# EAGLE design connection (EAGLE 7.2.1)
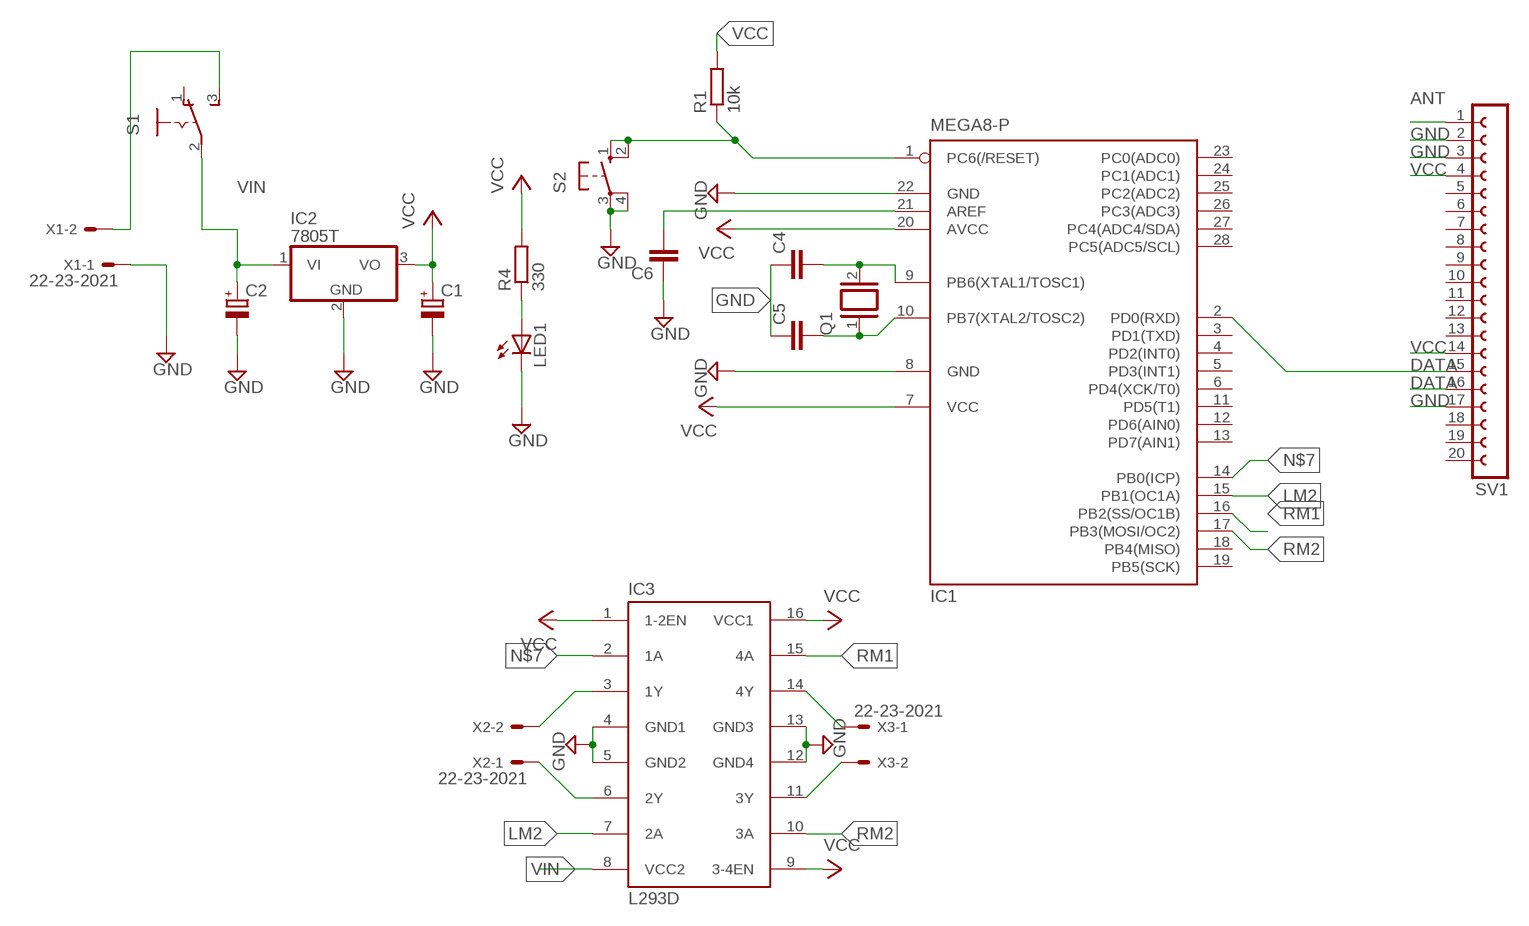
[diagram p0: schematic, sheet 1]

## Parts
C1  CPOL-EUE3.5-8  [E3,5-8]
C2  CPOL-EUE3.5-8  [E3,5-8]
C4  C5/2.5  [C5B2.5]
C5  C5/2.5  [C5B2.5]
C6  C5/2.5  [C5B2.5]
IC1  MEGA8-P  [DIL28-3]
IC2  7805T  [TO220H]
IC3  L293D  [DIL16]
LED1  LED5MM  [LED5MM]
Q1  XTAL/S  [QS]
R1  10k  R-EU_0207/10  [0207/10]
R4  330  R-EU_0207/10  [0207/10]
S1  255SB  [255SB]
S2  10-XX  [B3F-10XX]
SV1  FE20-1  [FE20]
X1  22-23-2021  [22-23-2021]
X2  22-23-2021  [22-23-2021]
X3  22-23-2021  [22-23-2021]

## Nets
ANT: SV1.1
DATA: IC1.2(PD0(RXD)) SV1.15 SV1.16
GND: C1.- C2.- C4.1 C5.1 C6.1 IC1.8(GND) IC1.22(GND) IC2.2(GND) IC3.4(GND1) IC3.5(GND2) IC3.12(GND4) IC3.13(GND3) LED1.K(C) S2.3(P) S2.4(P1) SV1.2 SV1.3 SV1.17 X1.1
LM2: IC1.15(PB1(OC1A)) IC3.7(2A)
N$1: IC1.1(PC6(/RESET)) R1.1 S2.1(S) S2.2(S1)
N$2: C6.2 IC1.21(AREF)
N$3: C4.2 IC1.9(PB6(XTAL1/TOSC1)) Q1.2
N$4: C5.2 IC1.10(PB7(XTAL2/TOSC2)) Q1.1
N$5: S1.3(S) X1.2
N$7: IC1.14(PB0(ICP)) IC3.2(1A)
N$8: IC3.3(1Y) X2.2
N$9: IC3.6(2Y) X2.1
N$10: IC3.14(4Y) X3.1
N$12: IC3.11(3Y) X3.2
N$13: LED1.A R4.1
RM1: IC1.16(PB2(SS/OC1B)) IC3.15(4A)
RM2: IC1.17(PB3(MOSI/OC2)) IC3.10(3A)
VCC: C1.+ IC1.7(VCC) IC1.20(AVCC) IC2.3(VO) IC3.1(1-2EN) IC3.9(3-4EN) IC3.16(VCC1) R1.2 R4.2 SV1.4 SV1.14
VIN: C2.+ IC2.1(VI) IC3.8(VCC2) S1.2(P)
Unconnected: IC1.3(PD1(TXD)) IC1.4(PD2(INT0)) IC1.5(PD3(INT1)) IC1.6(PD4(XCK/T0)) IC1.11(PD5(T1)) IC1.12(PD6(AIN0)) IC1.13(PD7(AIN1)) IC1.18(PB4(MISO)) IC1.19(PB5(SCK)) IC1.23(PC0(ADC0)) IC1.24(PC1(ADC1)) IC1.25(PC2(ADC2)) IC1.26(PC3(ADC3)) IC1.27(PC4(ADC4/SDA)) IC1.28(PC5(ADC5/SCL)) S1.1(O) SV1.5 SV1.6 SV1.7 SV1.8 SV1.9 SV1.10 SV1.11 SV1.12 SV1.13 SV1.18 SV1.19 SV1.20

## Library data of the parts
C1 C2 = resistor:CPOL-EU: POLARIZED CAPACITOR, European symbol
C4-C6 = capacitor-wima:C: CAPACITOR naming: grid - package width
IC1 = atmel:MEGA8-P: MICROCONTROLLER 8 Kbytes FLASH, 1 kbytes SRAM, 512 bytes EEPROM, USART, 4-channel 10 bit ADC, 2-channel 8 bit ADC Pin compatible with Atmega48, ATMega88, ATMega168 Source: avr.lbr; OC_FARNELL: unknown; OC_NEWARK: unknown
IC2 = linear:78*: Positive VOLTAGE REGULATOR Source: http://cache.national.com/ds/LM/LM78L05.pdf http://www.fairchildsemi.com/ds/LM/LM7805.pdf
IC3 = st-microelectronics:L293D: PUSH-PULL 4 CHANNEL DRIVER; MPN: L293D; OC_FARNELL: 9589619; OC_NEWARK: 56P8249
LED1 = led:LED: LED OSRAM: - CHIPLED LG R971, LG N971, LY N971, LG Q971, LY Q971, LO R971, LY R971 LH N974, LH R974 LS Q976, LO Q976, LY Q976 LO Q996 - Hyper CHIPLED LW Q18S LB Q993, LB Q99A, LB R99A - SideLED LS A670, LO A670, LY A670, LG A670, LP A670 LB A673, LV A673, LT A673, LW A673 LH A674 LY A675 LS A676, LA A676, LO A676, LY A676, LW A676 LS A679, LY A679, LG A679 - Hyper Micro SIDELED® LS Y876, LA Y876, LO Y876, LY Y876 LT Y87S - SmartLED LW L88C, LW L88S LB L89C, LB L89S, LG L890 LS L89K, LO L89K, LY L89K LS L896, LA L896, LO L896, LY L896 - TOPLED LS T670, LO T670, LY T670, LG T670, LP T670 LSG T670, LSP T670, LSY T670, LOP T670, LYG T670 LG T671, LOG T671, LSG T671 LB T673, LV T673, LT T673, LW T673 LH T674 LS T676, LA T676, LO T676, LY T676, LB T676, LH T676, LSB T676, LW T676 LB T67C, LV T67C, LT T67C, LS T67K, LO T67K, LY T67K, LW E67C LS E67B, LA E67B, LO E67B, LY E67B, LB E67C, LV E67C, LT E67C LW T67C LS T679, LY T679, LG T679 LS T770, LO T770, LY T770, LG T770, LP T770 LB T773, LV T773, LT T773, LW T773 LH T774 LS E675, LA E675, LY E675, LS T675 LS T776, LA T776, LO T776, LY T776, LB T776 LHGB T686 LT T68C, LB T68C - Hyper Mini TOPLED® LB M676 - Mini TOPLED Santana® LG M470 LS M47K, LO M47K, LY M47K Source: http://www.osram.convergy.de LUXEON: - LUMILED® LXK2-PW12-R00, LXK2-PW12-S00, LXK2-PW14-U00, LXK2-PW14-V00 LXK2-PM12-R00, LXK2-PM12-S00, LXK2-PM14-U00 LXK2-PE12-Q00, LXK2-PE12-R00, LXK2-PE12-S00, LXK2-PE14-T00, LXK2-PE14-U00 LXK2-PB12-K00, LXK2-PB12-L00, LXK2-PB12-M00, LXK2-PB14-N00, LXK2-PB14-P00, LXK2-PB14-Q00 LXK2-PR12-L00, LXK2-PR12-M00, LXK2-PR14-Q00, LXK2-PR14-R00 LXK2-PD12-Q00, LXK2-PD12-R00, LXK2-PD12-S00 LXK2-PH12-R00, LXK2-PH12-S00 LXK2-PL12-P00, LXK2-PL12-Q00, LXK2-PL12-R00 Source: www.luxeon.com KINGBRIGHT: KA-3528ASYC Source: www.kingbright.com
Q1 = special:XTAL/S: CRYSTAL
R1 R4 = resistor:R-EU_: RESISTOR, European symbol
S1 = switch:255SB: SLIDING SWITCH Distributor Buerklin, 11G810
S2 = switch-omron:10-XX: OMRON SWITCH; MPN: B3F-1000; OC_FARNELL: 176432; OC_NEWARK: 36M3542
SV1 = con-lsta:FE20-1: FEMALE HEADER; OC_FARNELL: unknown; OC_NEWARK: unknown
X1-X3 = con-molex:22-23-2021: .100" (2.54mm) Center Header - 2 Pin; MF: MOLEX; MPN: 22-23-2021; OC_FARNELL: 1462926; OC_NEWARK: 25C3832

## Board
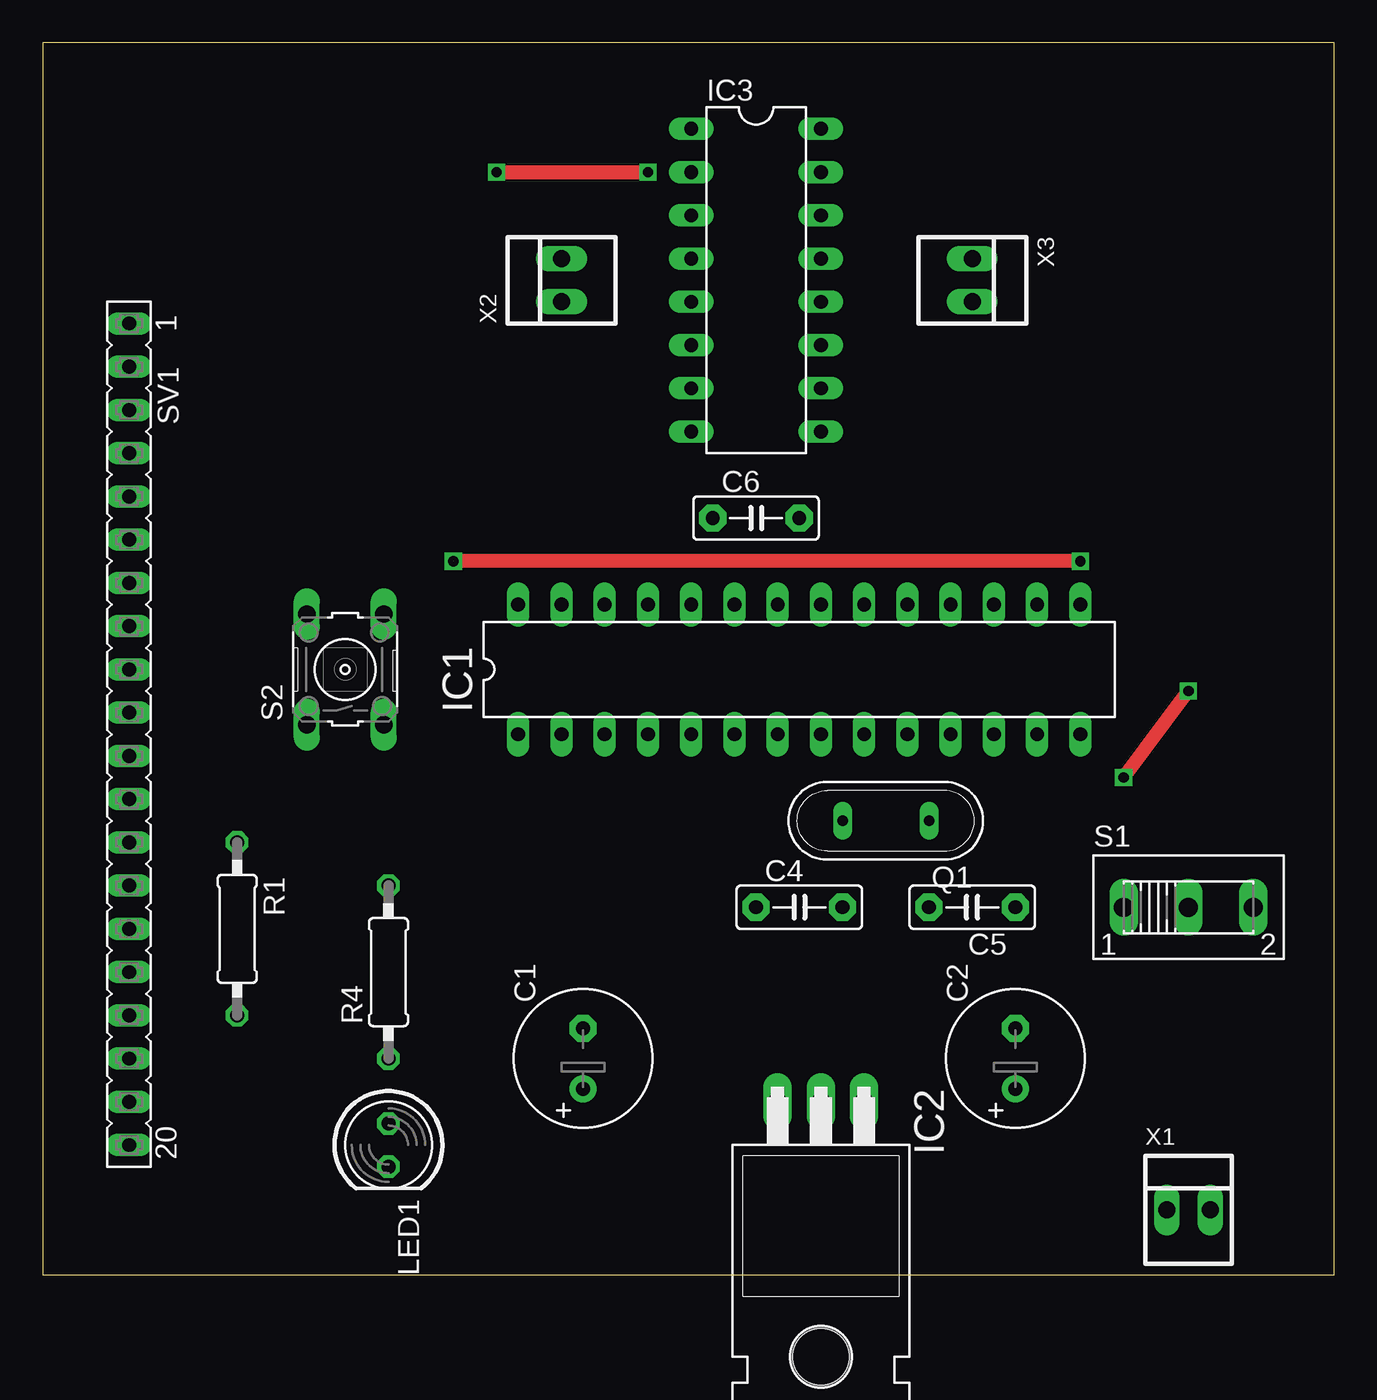
[diagram p1: board, top side]
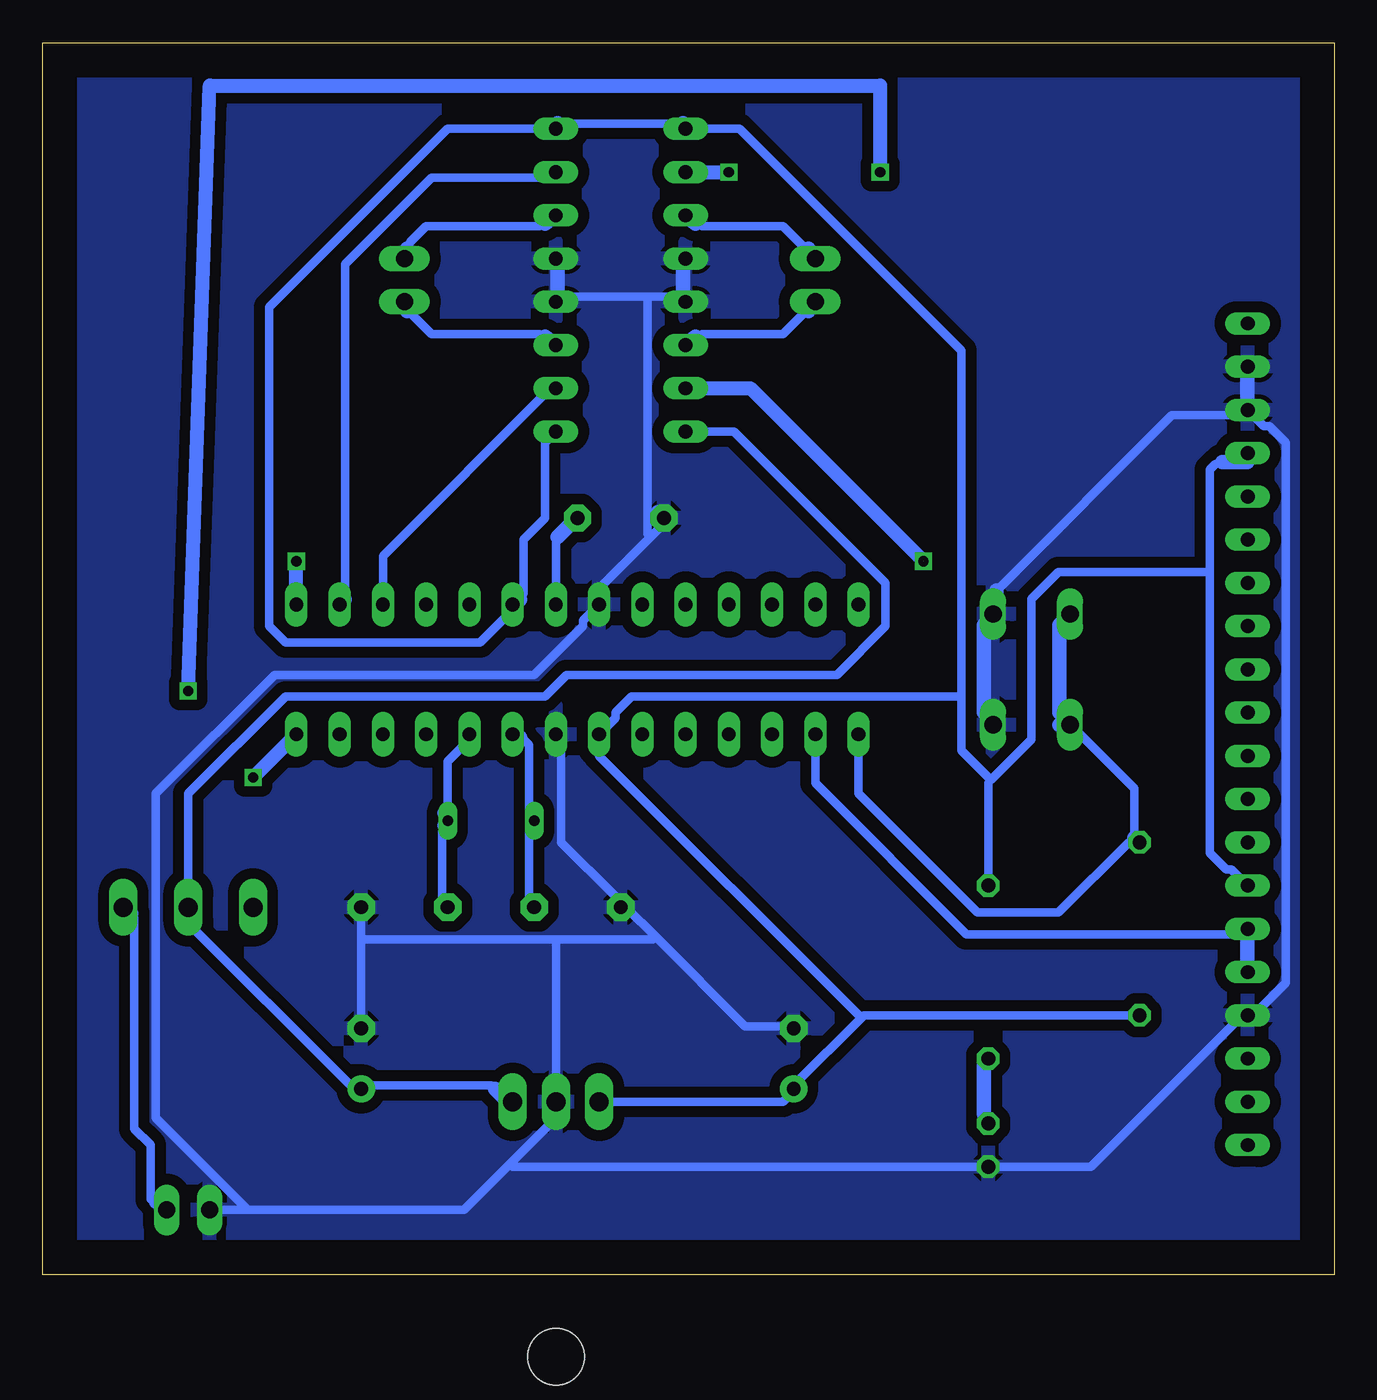
[diagram p2: board, bottom side, seen from below]

Size 75.87 x 72.38 mm. Coordinates in mm from the lower left corner, seen from the top.
Outline: 0,0 75.87,0 75.87,72.38 0,72.38 0,0
Copper layers (1*16): Top 0.035mm / dielectric 1.5mm / Bottom 0.035mm
Design rules "default *": minimum track width 20mil, minimum drill 24mil, track to track 25mil, track to pad 30mil, pad to pad 25mil, via to via 25mil, smd to smd 25mil, copper to edge 80mil, drill to drill 8mil, minimum pad ring 10mil, minimum via ring 8mil, stop-mask expansion 4mil, vias tented up to drill 0mil, thermal gap 10mil

### Footprints (pad centres in the part's own frame; a part is rotated, then mirrored left to right if it is on the bottom)
E3,5-8 = drill 0.813 pad 1.6: + -1.778,0 | drill 0.813 pad 1.6 octagon: - 1.778,0
C5B2.5 = drill 0.813 pad 1.6 octagon: 1 -2.54,0; 2 2.54,0
DIL28-3 = drill 0.813 long: 1 -16.51,-3.81; 2 -13.97,-3.81; 3 -11.43,-3.81; 4 -8.89,-3.81; 5 -6.35,-3.81; 6 -3.81,-3.81; 7 -1.27,-3.81; 8 1.27,-3.81; 9 3.81,-3.81; 10 6.35,-3.81; 11 8.89,-3.81; 12 11.43,-3.81; 13 13.97,-3.81; 14 16.51,-3.81; 15 16.51,3.81; 16 13.97,3.81; 17 11.43,3.81; 18 8.89,3.81; 19 6.35,3.81; 20 3.81,3.81; 21 1.27,3.81; 22 -1.27,3.81; 23 -3.81,3.81; 24 -6.35,3.81; 25 -8.89,3.81; 26 -11.43,3.81; 27 -13.97,3.81; 28 -16.51,3.81
TO220H = drill 1.118 long: 1 -2.54,-10.16; 2 0,-10.16; 3 2.54,-10.16 | hole 3.302: 0,4.826
DIL16 = drill 0.813 long: 1 -8.89,-3.81; 2 -6.35,-3.81; 3 -3.81,-3.81; 4 -1.27,-3.81; 5 1.27,-3.81; 6 3.81,-3.81; 7 6.35,-3.81; 8 8.89,-3.81; 9 8.89,3.81; 10 6.35,3.81; 11 3.81,3.81; 12 1.27,3.81; 13 -1.27,3.81; 14 -3.81,3.81; 15 -6.35,3.81; 16 -8.89,3.81
LED5MM = drill 0.813 octagon: A -1.27,0; K 1.27,0
QS = drill 0.61 long: 1 -2.54,0; 2 2.54,0
0207/10 = drill 0.813 octagon: 1 -5.08,0; 2 5.08,0
255SB = drill 1.118 long: 1 -3.81,0; 2 0,0; 3 3.81,0
B3F-10XX = drill 1.016 long: 1 -3.251,2.261; 2 3.251,2.261; 3 -3.251,-2.261; 4 3.251,-2.261
FE20 = drill 0.813 long: 1 -24.13,0; 2 -21.59,0; 3 -19.05,0; 4 -16.51,0; 5 -13.97,0; 6 -11.43,0; 7 -8.89,0; 8 -6.35,0; 9 -3.81,0; 10 -1.27,0; 11 1.27,0; 12 3.81,0; 13 6.35,0; 14 8.89,0; 15 11.43,0; 16 13.97,0; 17 16.51,0; 18 19.05,0; 19 21.59,0; 20 24.13,0
22-23-2021 = drill 1 long: 1 -1.27,0; 2 1.27,0

### Placement (x,y rotation side)
C1  31.75,12.7 90 top
C2  57.15,12.7 90 top
C4  44.45,21.59 0 top
C5  54.61,21.59 180 top
C6  41.91,44.45 0 top
IC1  44.45,35.56 0 top
IC2  45.72,0 180 top
IC3  41.91,58.42 270 top
LED1  20.32,7.62 270 top
Q1  49.53,26.67 180 top
R1  11.43,20.32 270 top
R4  20.32,17.78 90 top
S1  67.31,21.59 0 top
S2  17.78,35.56 90 top
SV1  5.08,31.75 270 top
X1  67.31,3.81 0 top
X2  30.48,58.42 90 top
X3  54.61,58.42 270 top

### Tracks (layer width: path | path; a pad name or v marks a point on that pad's centre or on a via)
DATA
  Bottom 0.508: IC1.2 30.48,28.89 21.59,20 5.4,20 SV1.15
  Bottom 0.838: SV1.16 5.1,18.29 5.1,19.76 SV1.15
GND
  Bottom 0.508: 19.84,40.18 19.68,40.32 9.52,50.48 5.4,50.48 SV1.3 4.13,49.85 3.81,49.85 2.86,48.89 2.86,17.14 4.76,15.24 SV1.17 5.4,15.24 14.29,6.35 LED1.K 48.26,6.35 48.42,6.51 | C5.1 57.15,19.69 | 57.15,19.69 C2.- | IC1.8 45.4,31.43 45.4,25.4 42.23,22.23 C4.1 41.59,21.59 39.85,19.84 | 39.85,19.84 34.61,14.6 31.75,14.6 C1.- | 45.72,19.69 40.01,19.69 39.85,19.84 | 45.72,19.69 57.15,19.69 | 40.32,57.47 45.4,57.47 IC3.12 | 40.32,57.47 38.42,57.47 IC3.5 | 40.16,43.34 39.37,44.13 C6.1 | 40.16,43.34 43.18,40.32 IC1.22 44.13,38.42 44.13,38.1 46.99,35.24 62.23,35.24 69.22,28.26 69.22,9.21 63.82,3.81 | 40.32,57.47 40.32,43.5 40.16,43.34 | 63.82,3.81 51.12,3.81 48.42,6.51 | 63.82,3.81 X1.1 | 48.42,6.51 45.72,9.21 IC2.2 45.72,19.69
  Bottom 0.838: SV1.2 5.1,52.91 5.1,51.43 SV1.3 5.1,50.7 | S2.3 20.57,33.02 20.57,38.18 S2.4 19.84,40.18 | 45.62,31.55 IC1.8 | 41.94,21.97 C4.1 | IC3.4 38.25,59.54 38.25,57.33 IC3.5 | IC3.13 45.62,59.54 45.62,57.33 IC3.12 | 39.73,44.81 C6.1
  pour Bottom: 0,72.39 76.2,72.39 76.2,0 0,0
LM2  (via drill 0.6)  (1 unrouted)
  Top 0.813: v60.96,41.91 24.13,41.91
  Bottom 0.813: IC1.15 v60.96,41.91 | IC3.7 34.29,52.07 24.13,41.91
N$1
  Bottom 0.508: 11.73,25.65 11.75,26.04 11.75,28.57 15.24,32.07 S2.1 | IC1.1 27.94,28.26 20.95,21.27 16.19,21.27 12.06,25.4 R1.1
  Bottom 0.838: 11.73,25.65 R1.1 | 15.42,32.28 S2.1 | 16.15,32.28 S2.1 | S2.2 16.15,38.18 16.15,33.02 S2.1
N$2
  Bottom 0.508: IC1.21 45.72,43.18 45.62,43.33
  Bottom 0.838: 45.62,43.33 44.88,44.07 C6.2 | 45.62,39.65 IC1.21
N$3
  Bottom 0.508: C4.2 47.31,22.23 47.31,26.04 Q1.2 47.31,27.3 47.31,31.11 47.62,31.43 IC1.9
  Bottom 0.838: 47.09,26.39 Q1.2 47.09,27.13 | 47.09,21.97 C4.2 | 47.83,31.55 IC1.9
N$4
  Bottom 0.508: C5.2 52.39,22.23 52.39,26.04 Q1.1 52.07,30.16 50.8,31.43 IC1.10
  Bottom 0.838: 52.25,26.39 Q1.1 52.25,27.13 | 52.25,21.97 C5.2 | 50.77,31.55 IC1.10
N$5
  Bottom 0.508: 69.19,4.29 69.53,4.45 69.53,7.62 70.48,8.57 70.48,20.96 S1.3
  Bottom 0.838: 69.19,4.29 X1.2 | 70.66,21.23 S1.3
N$6  (via drill 0.6)
  other vias: 24.13,41.91
N$7  (via drill 0.6)
  Top 0.813: v63.5,29.21 v67.31,34.29 | v26.67,64.77 v35.56,64.77
  Bottom 0.813: v67.31,34.29 66.04,69.85 26.67,69.85 v26.67,64.77 | IC1.14 v63.5,29.21 | IC3.2 v35.56,64.77
N$8
  Bottom 0.508: X2.2 32.38,61.59 37.15,61.59 IC3.3
  Bottom 0.838: 37.52,61.75 IC3.3 | 30.89,60.27 X2.2
N$9
  Bottom 0.508: X2.1 32.38,55.24 37.15,55.24 IC3.6
  Bottom 0.838: 37.52,55.12 IC3.6 | 30.89,56.59 X2.1
N$10
  Bottom 0.508: IC3.14 46.67,61.59 53.34,61.59 54.29,60.64 54.46,60.27
  Bottom 0.838: 46.35,61.75 IC3.14 | 54.46,60.27 X3.1
N$12
  Bottom 0.508: IC3.11 46.67,55.24 53.02,55.24 54.29,56.52 X3.2
  Bottom 0.838: 46.35,55.12 IC3.11 | 54.46,56.59 X3.2
N$13
  Bottom 0.838: LED1.A 20.57,9.45 20.57,12.39 R4.1
RM1
  Bottom 0.508: IC1.16 58.1,40 58.1,59.37 53.02,64.45 46.67,64.45 IC3.15
  Bottom 0.838: 46.35,64.69 IC3.15 | 58.14,39.65 IC1.16
RM2
  Bottom 0.508: IC1.17 55.88,42.23 46.04,52.07 IC3.10
VCC
  Bottom 0.508: R1.2 27.62,15.24 27.78,15.08 | 27.78,15.08 31.75,11.11 C1.+ 31.75,10.79 32.38,10.16 IC2.3 | 27.78,15.08 43.18,30.48 IC1.7 42.23,32.7 42.23,33.02 41.27,33.97 21.91,33.97 | IC3.9 46.35,48.89 46.35,44.45 47.62,43.18 47.62,40 IC1.20 48.26,39.05 50.16,37.15 61.59,37.15 62.55,38.1 62.55,56.83 52.07,67.31 IC3.16 45.4,67.63 38.42,67.63 IC3.1 34.92,67.31 21.91,54.29 21.91,33.97 | SV1.14 6.03,23.81 6.35,23.81 7.3,24.77 7.3,41.27 | 7.3,41.27 7.3,47.31 6.98,47.62 6.58,47.75 | R4.2 20.32,28.89 20.16,29.05 | 20.16,29.05 17.78,31.43 17.78,39.69 16.19,41.27 7.3,41.27 | 21.91,33.97 21.91,30.8 20.16,29.05
  Bottom 0.838: 38.25,67.64 IC3.1 | 45.62,67.64 IC3.16 | 47.83,39.65 IC1.20 | 46.35,49.22 IC3.9 | 6.58,47.75 5.1,47.75 SV1.4
VIN
  Bottom 0.508: 49.3,10.92 49.53,11.11 56.83,11.11 C2.+ 57.78,11.11 67.63,20.96 S1.2 67.31,28.26 61.59,33.97 46.35,33.97 45.09,35.24 29.21,35.24 26.35,38.1 26.35,40.64 35.24,49.53 IC3.8
  Bottom 0.838: 49.3,10.92 48.56,10.18 IC2.1 | 57.4,10.92 C2.+ | 67.72,21.23 S1.2